# Altium schematic sheet RemoteControl.SchDoc: RemoteControl
size A4; CompanyName: BUPT; DrawnBy: BUPT_HCM; Engineer: BUPT_HCM; Organization: BUPT_Robot; Revision: A; SheetNumber: 1; SheetTotal: 1; Version: 1.0; LibVersion: 3.0
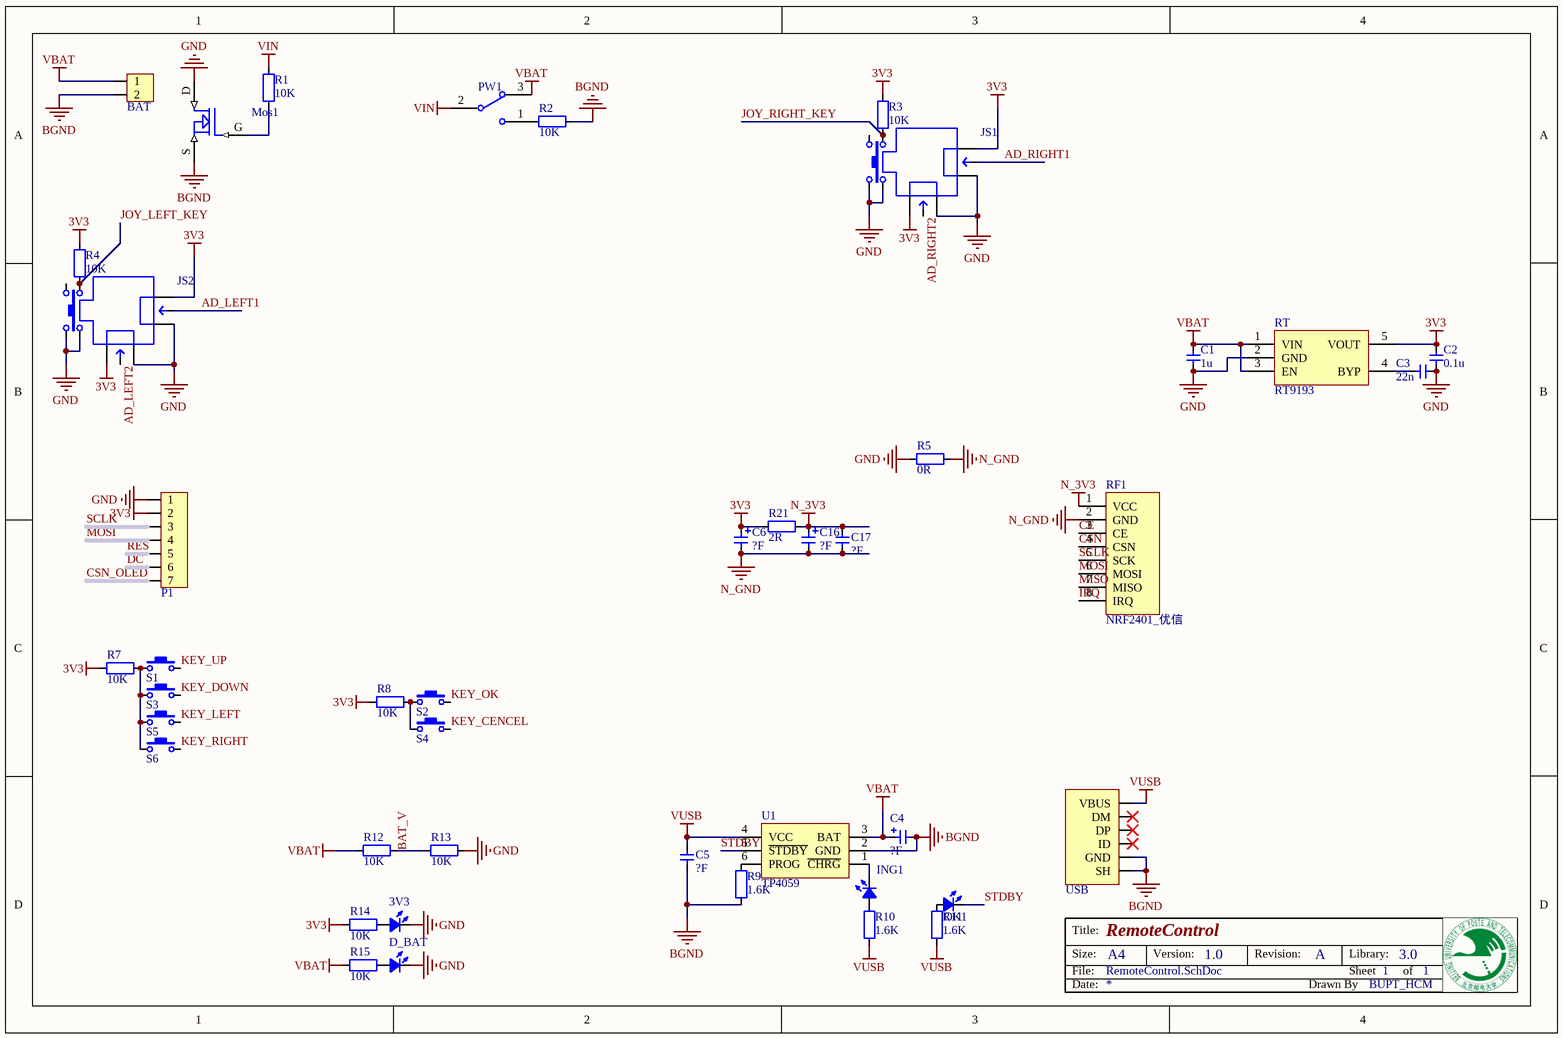
[diagram p0: RemoteControl.SchDoc]

## Parts
3V3  LED_0805  [LED_0805_RED]  (value not drawn)
BAT  HDR1x2_2.54  [HDR1X2_2.54_90]  (value not drawn)
C1  value 1u  [CAP_0603]  (hidden comment: Cap_0603)
C2  value 0.1u  [CAP_0603]  (hidden comment: Cap_0603)
C3  value 22n  [CAP_0603]  (hidden comment: Cap_0603)
C4  value ?F  [CAP_TAN_D2917]  (hidden comment: Cap_Tan_2917)
C5  value ?F  [CAP_0805]  (hidden comment: Cap_0805)
C6  value ?F  [CAP_TAN_A1206]  (hidden comment: Cap_Tan_1206)
C16  value ?F  [CAP_TAN_A1206]  (hidden comment: Cap_Tan_1206)
C17  value ?F  [CAP_0603]  (hidden comment: Cap_0603)
D_BAT  LED_0805  [LED_0805_RED]  (value not drawn)
ING1  LED_0805  [LED_0805_RED]  (value not drawn)
JS1  JoyStick  [JoyStick]  (value not drawn)
JS2  JoyStick  [JoyStick]  (value not drawn)
Mos1  MOSFET N  [Nmos_SOT23]  (value not drawn)
OK1  LED_0805  [LED_0805_GREEN]  (value not drawn)
P1  HDR1x7_2.54  [HDR1X7_2.54_180]  (value not drawn)
PW1  SwitchSPDT_2.8x6.6_90  [SwitchSPDT_2.8X6.6_90]  (value not drawn)
R1  value 10K  [RES_0603]  (hidden comment: Res_0603)
R2  value 10K  [RES_0603]  (hidden comment: Res_0603)
R3  value 10K  [RES_0603]  (hidden comment: Res_0603)
R4  value 10K  [RES_0603]  (hidden comment: Res_0603)
R5  value 0R  [RES_0603]  (hidden comment: Res_0603)
R7  value 10K  [RES_0603]  (hidden comment: Res_0603)
R8  value 10K  [RES_0603]  (hidden comment: Res_0603)
R9  value 1.6K  [RES_0603]  (hidden comment: Res_0603)
R10  value 1.6K  [RES_0603]  (hidden comment: Res_0603)
R11  value 1.6K  [RES_0603]  (hidden comment: Res_0603)
R12  value 10K  [RES_0603]  (hidden comment: Res_0603)
R13  value 10K  [RES_0603]  (hidden comment: Res_0603)
R14  value 10K  [RES_0603]  (hidden comment: Res_0603)
R15  value 10K  [RES_0603]  (hidden comment: Res_0603)
R21  value 2R  [RES_0603]  (hidden comment: Res_0603)
RF1  NRF2401_优信  [nrf24l01_youxin]
RT  RT9193  [SOT23-5]
S1  ButtonTACT_3x6x2.5_180  [ButtonTACT_3x6x2.5_180]  (value not drawn)
S2  ButtonTACT_3x6x2.5_180  [ButtonTACT_3x6x2.5_180]  (value not drawn)
S3  ButtonTACT_3x6x2.5_180  [ButtonTACT_3x6x2.5_180]  (value not drawn)
S4  ButtonTACT_3x6x2.5_180  [ButtonTACT_3x6x2.5_180]  (value not drawn)
S5  ButtonTACT_3x6x2.5_180  [ButtonTACT_3x6x2.5_180]  (value not drawn)
S6  ButtonTACT_3x6x2.5_180  [ButtonTACT_3x6x2.5_180]  (value not drawn)
U1  TP4059  [SOT23-6]
USB  USB_Micro  [USB_Micro-AB]  (value not drawn)

## Nets
3V3: C2.2 C6.1 JS1.1 JS1.6 JS2.1 JS2.6 P1.2 R3.2 R4.2 R7.2 R8.2 R14.1 R21.2 RT.5(VOUT)
BGND: BAT.2 C4.2 C5.1 Mos1.S R2.2 R9.2 U1.2(GND) USB.0(SH) USB.5(GND)
GND: 3V3.2(K) C1.1 C2.1 C3.1 D_BAT.2(K) JS1.3 JS1.4 JS1.8 JS1.10 JS2.3 JS2.4 JS2.8 JS2.10 Mos1.D P1.1 R5.2 R13.1 RT.2(GND)
N_3V3: C16.1 C17.2 R21.1 RF1.1(VCC)
N_GND: C6.2 C16.2 C17.1 R5.1 RF1.2(GND)
VBAT: BAT.1 C1.2 C4.1 PW1.3 R12.2 R15.1 RT.1(VIN) RT.3(EN) U1.3(BAT)
VIN: PW1.2 R1.2
VUSB: C5.2 R10.2 R11.2 U1.4(VCC) USB.1(VBUS)
AD_LEFT1: JS2.5
AD_LEFT2: JS2.2
AD_RIGHT1: JS1.5
AD_RIGHT2: JS1.2
BAT_V: R12.1 R13.2
CE: RF1.3(CE)
CSN: RF1.4(CSN)
CSN_OLED: P1.7
DC: P1.6
IRQ: RF1.8(IRQ)
JOY_LEFT_KEY: JS2.9 R4.1
JOY_RIGHT_KEY: JS1.9 R3.1
KEY_CENCEL: S4.2
KEY_DOWN: S3.2
KEY_LEFT: S5.2
KEY_OK: S2.2
KEY_RIGHT: S6.2
KEY_UP: S1.2
MISO: RF1.7(MISO)
MOSI: P1.4 RF1.6(MOSI)
RES: P1.5
SCLK: P1.3 RF1.5(SCK)
STDBY: OK1.2(K) U1.5(~{STDBY})
Net3V3_1: 3V3.1(A) R14.2
NetC3_2: C3.2 RT.4(BYP)
NetD_BAT_1: D_BAT.1(A) R15.2
NetING1_1: ING1.1(A) R10.1
NetING1_2: ING1.2(K) U1.1(~{CHRG})
NetMos1_G: Mos1.G R1.1
NetOK1_1: OK1.1(A) R11.1
NetPW1_1: PW1.1 R2.1
NetR7_1: R7.1 S1.1 S3.1 S5.1 S6.1
NetR8_1: R8.1 S2.1 S4.1
NetR9_1: R9.1 U1.6(PROG)

Not connected (* = marked no-connect by the designer): JS1 7; JS2 7; USB 2(DM)* 3(DP)* 4(ID)*

## Notes on the sheet
- Title:
- Size:
- Date:
- File:
- A4
- Version:
- Revision:
- Drawn By
- Sheet
- Library:
- of

## Library data of the parts
3V3 D_BAT ING1 OK1 = LED_0805: LED
BAT = HDR1x2_2.54: Header
C1-C3 C17 = Cap_0603: Capacitor
C4 = Cap_Tan_2917: Capacitor
C5 = Cap_0805: Capacitor
C6 C16 = Cap_Tan_1206: Capacitor
Mos1 = MOSFET N: MOS SOT23
P1 = HDR1x7_2.54T: Header
PW1 = SwitchSPDT_2.8x6.6_90: Switch
R1-R5 R7-R15 R21 = Res_0603: Resistor
RT = RT9193: Power
S1-S6 = ButtonTACT_3x6x2.5_180: Button
USB = USB_Micro: USB